# EAGLE design bikealarm (EAGLE 9.2.2)
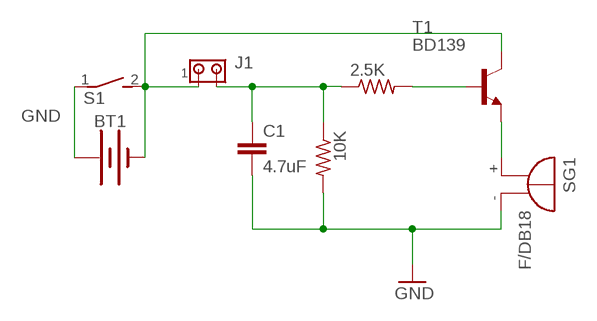
[diagram p0: schematic, sheet 1]

## Parts
2.5K  R-US_0204/7  [0204/7]
10K  R-US_0204/7  [0204/7]
BT1  BATTERY-AA-HOLDER_KIT  [BATTERY-AA-HOLDER-KIT]
C1  4.7uF  C-EU025-030X050  [C025-030X050]
J1  MTA02-156  [1X2MTA]
S1  DS01E  [DS-01]
SG1  F/DB18  [F/DB18]
T1  BD139  [TO126]

## Nets
GND: 10K.2 BT1.P(+) C1.2 S1.1 SG1.-
N$1: SG1.+ T1.1(E)
N$2: 2.5K.2 T1.3(B)
N$3: 2.5K.1 10K.1 C1.1 J1.2
N$4: BT1.N(-) J1.1 S1.2 T1.2(C)

## Library data of the parts
2.5K 10K = rcl:R-US_: RESISTOR, American symbol; SPICEPREFIX: R
BT1 = SparkFun-Batteries:BATTERY: Battery - Single Cell A variety of battery chemistries, sizes, and footprints. Device List: 20MM_PTH - Coin Cell Battery Holder - 20mm (PTH) <https://www.sparkfun.com/products/783> 20MM_PTH_KIT- Coin Cell battery Holder - 20 mm (PTH) <http://www.sparkfun.com/products/783>kit version with special mask 6.8MM_PTH - Coin Cell Battery Holder - 6.8MM(SMD) <https://www.digikey.com/product-detail/en/seiko-instruments/MS621FE-FL11E/728-1057-ND/1889208?WT.srch=1&gclid=CNOQ5a6LzdQCFZS2wAodXCkE0g> 12MM_SMD - Coin Cell Battery Holder - 12mm (SMD) <https://www.sparkfun.com/products/10592> 12MM_PTH - Coin Cell Battery Holder - 12mm (PTH) <https://www.sparkfun.com/products/7948> 20MM_SMD - 20mm Coin Cell Battery Holder (SMD) (2 legs) Used on the Big Time Watch Kit <https://www.sparkfun.com/products/11734> 20MM_SMD_4LEGS - Coin Cell Battery Holder - 20mm (SMD) <https://www.sparkfun.com/products/11892> 20MM_SMD_4LEGS_OVERPASTE - Coin Cell Battery Holder - 20mm (SMD) <https://www.sparkfun.com/products/11892> (Over-paste on the legs) 24.5MM_PTH - Coin Cell Battery Holder - 24.5mm (PTH) <https://www.sparkfun.com/products/8863> 9V - 9V Battery Holder - PC Mount Used on the SparkFun SparkPunk Sound Kit <https://www.sparkfun.com/products/11177> and SparkFun SparkPunk Sequencer Kit <https://www.sparkfun.com/products/12707> 18650 - Battery Holder - 18650 (PTH) <https://www.sparkfun.com/products/13113> AA - Battery Holder - 1xAA (PTH) <https://www.sparkfun.com/products/7949> AAA - Battery Holder - 1xAAA (PTH) <https://www.sparkfun.com/products/12718> AA_KIT - Battery Holder - 1xAA (PTH) <https://www.sparkfun.com/products/7949> Special kit package - pads only have exposed copper on one side of the board. AAA_KIT - Battery Holder - 1xAAA (PTH) <https://www.sparkfun.com/products/12718> Special kit package - pads only have exposed copper on one side of the board.
C1 = rcl:C-EU: CAPACITOR, European symbol; SPICEPREFIX: C
J1 = con-amp:MTA02-156: AMP connector
S1 = switch-dil:DS01E: DIL/CODE SWITCH; OC_FARNELL: unknown; OC_NEWARK: unknown
SG1 = buzzer:F/DB18: BUZZER Source: Buerklin; OC_FARNELL: unknown; OC_NEWARK: unknown
T1 = transistor:BD139: NPN TRANSISTOR

## Board
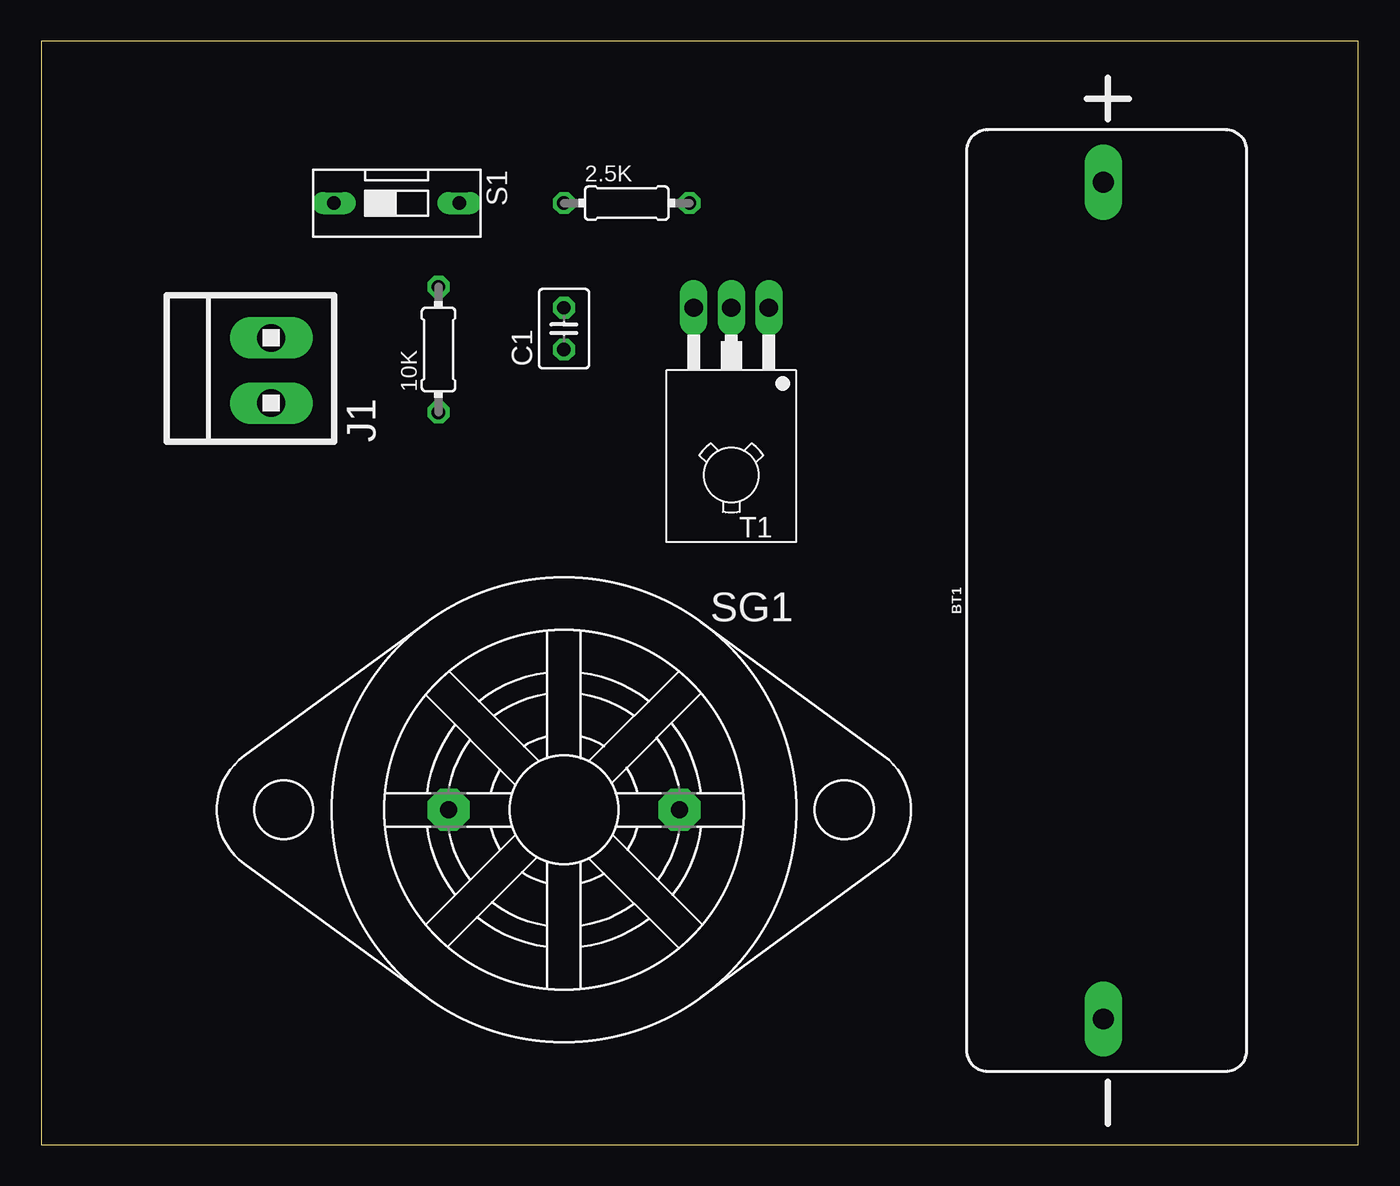
[diagram p1: board, top side]
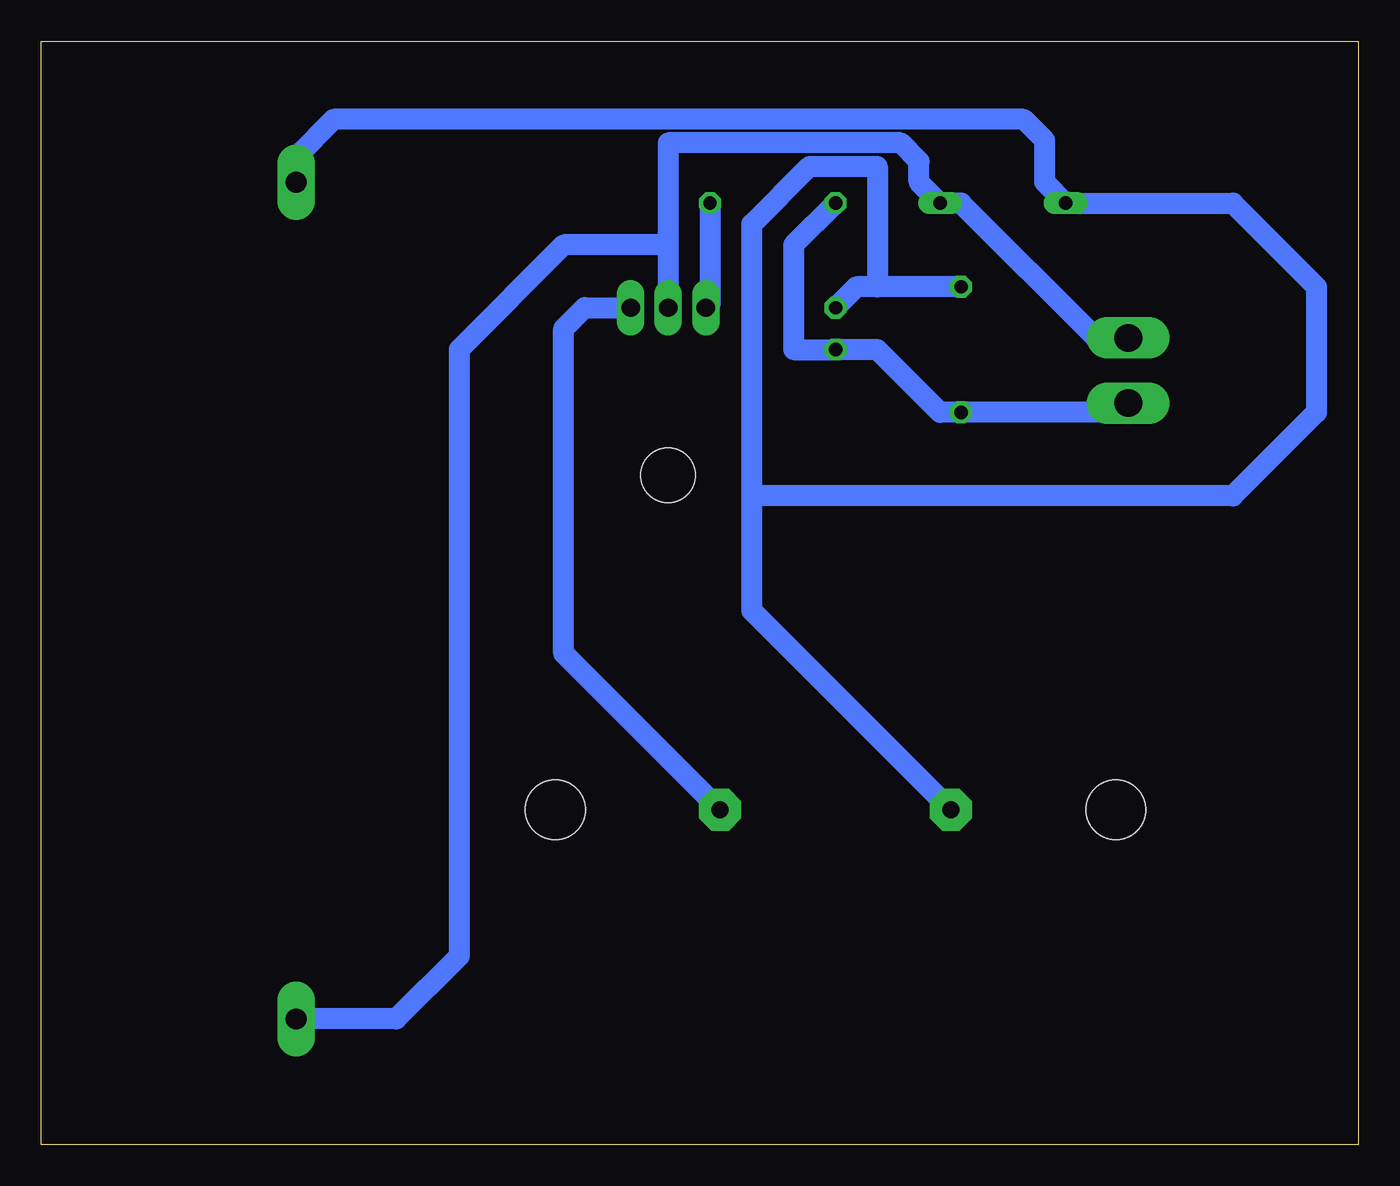
[diagram p2: board, bottom side, seen from below]

Size 79.99 x 66.98 mm. Coordinates in mm from the lower left corner, seen from the top.
Outline: 0,0 79.99,0 79.99,66.98 0,66.98 0,0
Copper layers (1*16): Top 0.035mm / dielectric 1.5mm / Bottom 0.035mm
Design rules "default": minimum track width 6mil, minimum drill 0.35mm, track to track 6mil, track to pad 6mil, pad to pad 6mil, via to via 6mil, smd to smd 6mil, copper to edge 40mil, drill to drill 6mil, minimum pad ring 10mil, minimum via ring 8mil, stop-mask expansion 4mil, vias tented up to drill 0mil, thermal gap 10mil

### Footprints (pad centres in the part's own frame; a part is rotated, then mirrored left to right if it is on the bottom)
0204/7 = drill 0.813 octagon: 1 -3.81,0; 2 3.81,0
BATTERY-AA-HOLDER-KIT = drill 1.27 pad 2.286 long: N -25.4,0.254; P 25.4,0.254
C025-030X050 = drill 0.813 octagon: 1 -1.27,0; 2 1.27,0
1X2MTA = drill 1.676 long: 1 1.981,0; 2 -1.981,0
DS-01 = drill 0.813 long: 1 0,-3.81; 2 0,3.81
F/DB18 = drill 1.016 pad 2.54 octagon: + 7.01,0; - -7.01,0 | hole 3.607: 17.018,0; -17.018,0
TO126 = drill 1.118 long: 1 -2.286,-5.08; 2 0,-5.08; 3 2.286,-5.08 | hole 3.302: 0,5.08

### Placement (x,y rotation side)
2.5K  35.56,57.15 0 top
10K  24.13,48.26 90 top
BT1  64.77,33.02 90 top
C1  31.75,49.53 90 top
J1  13.97,46.99 90 top
S1  21.59,57.15 270 top
SG1  31.75,20.32 0 top
T1  41.91,45.72 180 top

### Tracks (layer width: path | path; a pad name or v marks a point on that pad's centre or on a via)
GND
  Bottom 1.27: 10K.2 29.21,52.07 | 29.21,52.07 30.48,52.07 C1.2 | SG1.- 36.83,32.41 36.83,39.37 | 36.83,39.37 36.83,55.88 33.32,59.38 29.21,59.38 29.21,52.07 | BT1.P 64.52,59.94 62.23,62.23 20.32,62.23 19.05,60.96 19.05,58.42 S1.1 7.62,57.15 2.54,52.07 2.54,44.45 7.62,39.37 36.83,39.37
N$1
  Bottom 1.27: SG1.+ 48.26,29.82 48.26,49.53 46.99,50.8 T1.1
N$2
  Bottom 1.27: 2.5K.2 39.37,51.05 T1.3
N$3
  Bottom 1.27: J1.2 14.53,44.45 10K.1 25.4,44.45 29.21,48.26 C1.1 34.29,48.26 34.29,54.61 2.5K.1
N$4
  Bottom 1.27: J1.1 15.95,48.97 24.13,57.15 S1.2 26.67,58.42 26.67,59.69 27.79,60.81 41.91,60.81 41.91,54.61 | 41.91,54.61 T1.2 | 41.91,54.61 48.26,54.61 54.61,48.26 54.61,11.43 58.42,7.62 BT1.N